# Altium schematic sheet Э3-2.SchDoc
size 594 x 420 mm; Address1: Address1; Address2: Address2; Address3: Address3; Address4: Address4; SheetNumber: 2; SheetTotal: 12; DocumentType: Схема электрическая принципиальная; FirstReferrence: АБВГ.123456.001
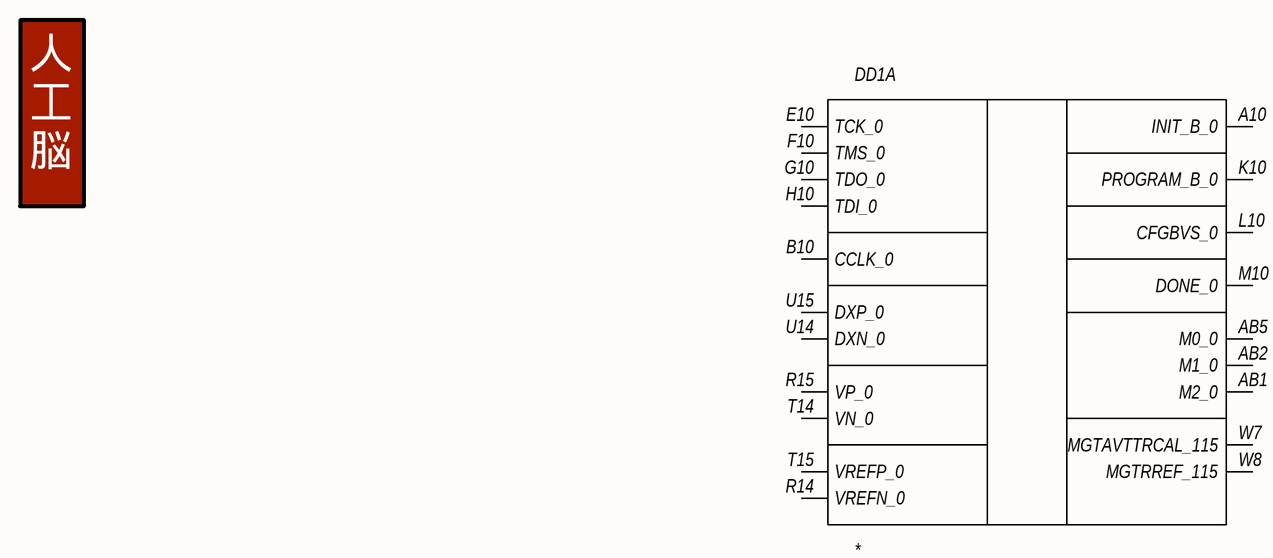
[diagram p0: Э3-2.SchDoc]

## Parts
DD1  *  [FF900/FFG900]  (value not drawn)  (part A of 19)

## Nets

Not connected (* = marked no-connect by the designer): DD1 A10(INIT_B_0) AB1(M2_0) AB2(M1_0) AB5(M0_0) B10(CCLK_0) E10(TCK_0) F10(TMS_0) G10(TDO_0) H10(TDI_0) K10(PROGRAM_B_0) L10(CFGBVS_0) M10(DONE_0) R14(VREFN_0) R15(VP_0) T14(VN_0) T15(VREFP_0) U14(DXN_0) U15(DXP_0) W7(MGTAVTTRCAL_115) W8(MGTRREF_115)

## Notes on the sheet
- 人
  工
  脳
- Перв. примен.
- Справ. №
- Подп. и дата
- Инв. № дубл.
- Взам. инв. №
- Инв. № подл.
- Изм.
- Лист
- № докум.
- Подп.
- Дата
- 2.106-A2
- Копировал
- Формат А2

## Library data of the parts
DD1 = XC7K325T-XFFG900: Kintex-7 FPGA; Manufacturer: Xilinx Inc.; TemperatureRange: -XX...+XX°C; Package: 900-FFG; ComponentType: IC; DatasheetURL: *; HelpURL: *; PinCount: 900; PartNumber: *